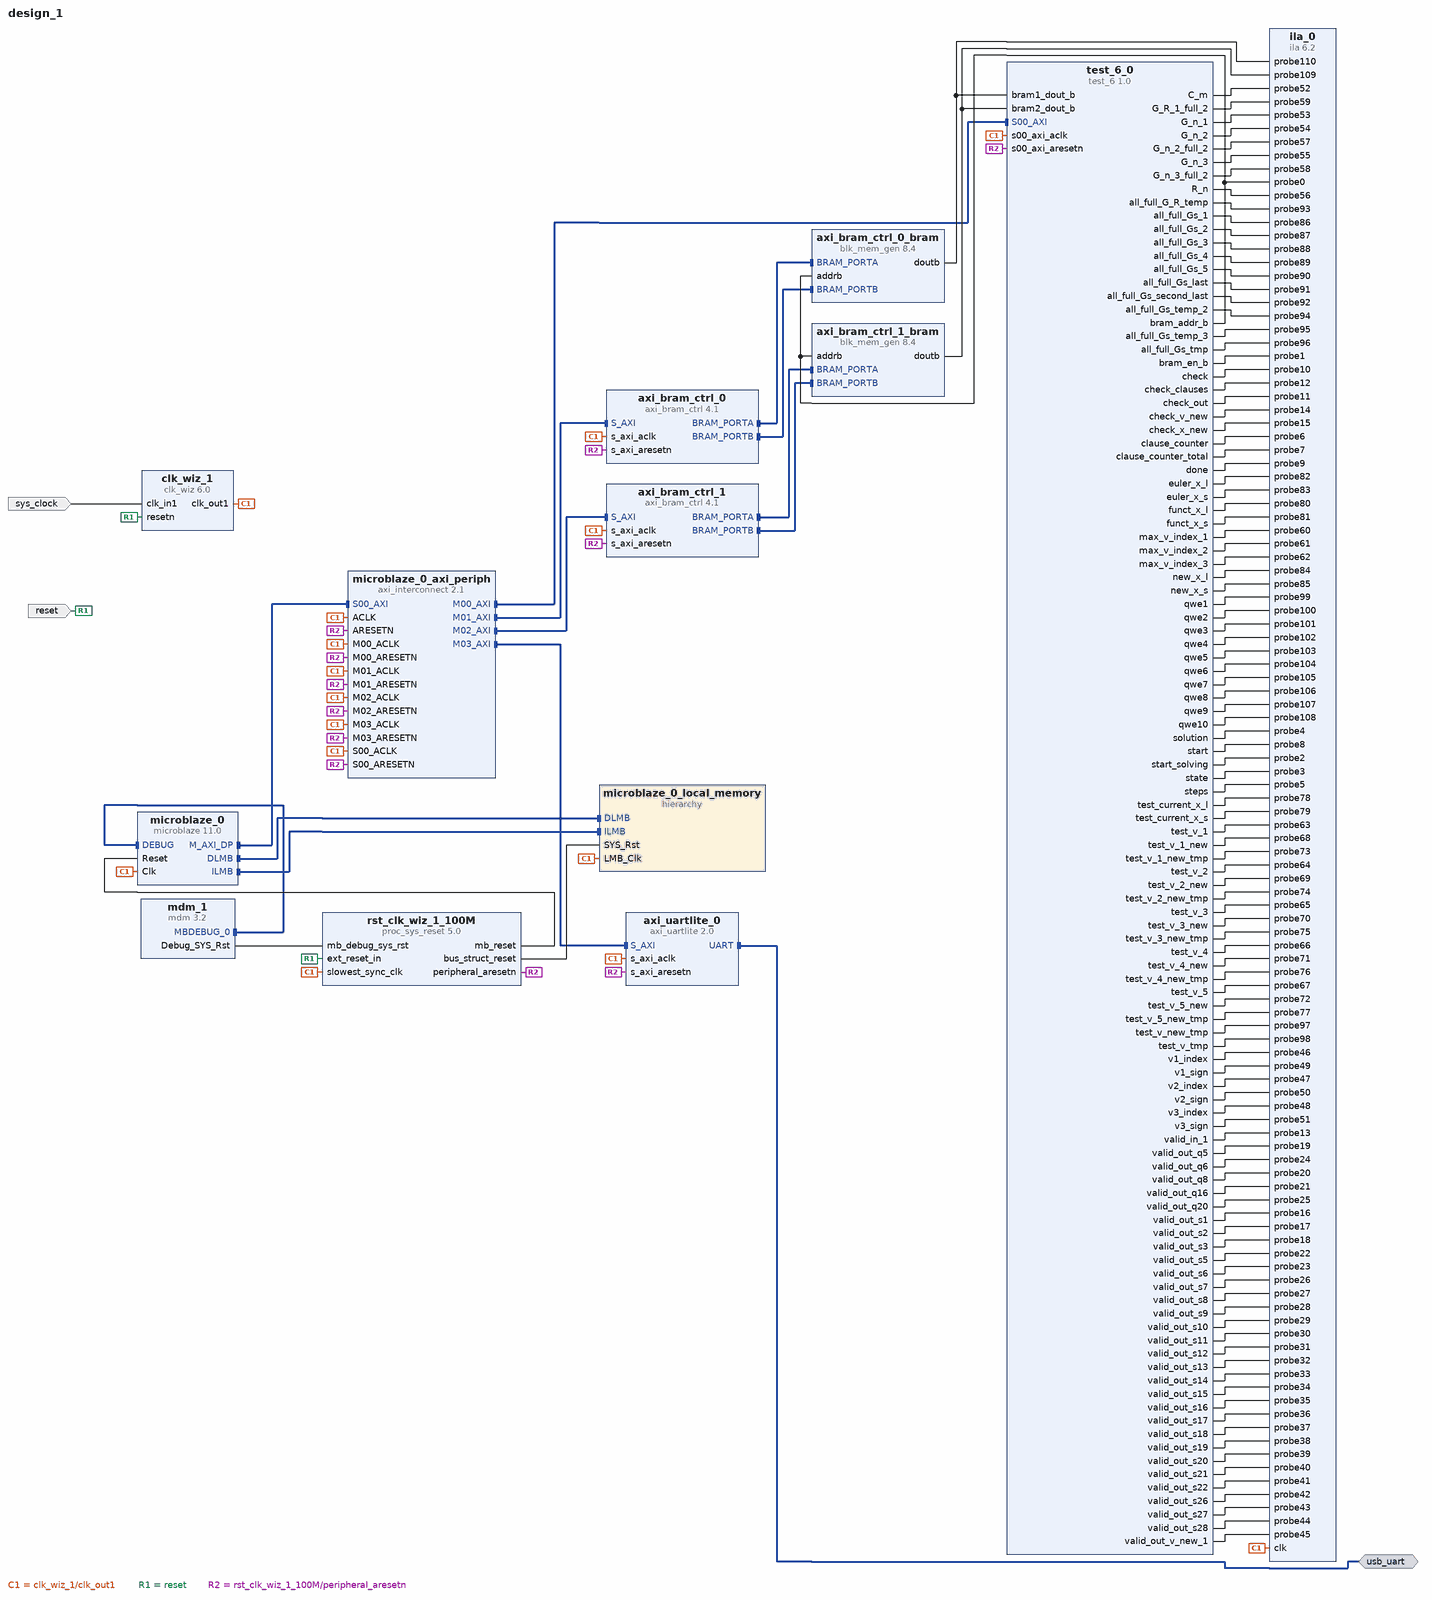
[diagram p0: block diagram of the top level]
# Vivado block design design_1, xc7a100tcsg324-1, Vivado 2023.1
create_bd_design design_1

create_bd_intf_port -mode Master -vlnv xilinx.com:interface:uart_rtl:1.0 usb_uart
create_bd_port -dir I -type clk sys_clock
set_property -dict {CONFIG.FREQ_HZ 100000000 CONFIG.PHASE 0.0} [get_bd_ports sys_clock]
create_bd_port -dir I -type rst reset
set_property -dict {CONFIG.POLARITY ACTIVE_LOW} [get_bd_ports reset]

create_bd_cell -type ip -vlnv xilinx.com:ip:microblaze:11.0 microblaze_0
set_property -dict {CONFIG.C_DEBUG_ENABLED 1 CONFIG.C_D_AXI 1 CONFIG.C_D_LMB 1 CONFIG.C_I_LMB 1} [get_bd_cells microblaze_0]
create_bd_cell -type hier microblaze_0_local_memory
create_bd_cell -type ip -vlnv xilinx.com:ip:mdm:3.2 mdm_1
create_bd_cell -type ip -vlnv xilinx.com:ip:clk_wiz:6.0 clk_wiz_1
set_property -dict [list \
  CONFIG.CLKOUT1_JITTER 137.143 \
  CONFIG.CLKOUT1_PHASE_ERROR 98.575 \
  CONFIG.CLKOUT1_REQUESTED_OUT_FREQ 80.000 \
  CONFIG.CLK_IN1_BOARD_INTERFACE sys_clock \
  CONFIG.MMCM_CLKFBOUT_MULT_F 10.000 \
  CONFIG.MMCM_CLKOUT0_DIVIDE_F 12.500 \
  CONFIG.PRIM_SOURCE Single_ended_clock_capable_pin \
  CONFIG.RESET_BOARD_INTERFACE reset \
  CONFIG.RESET_PORT resetn \
  CONFIG.RESET_TYPE ACTIVE_LOW \
  CONFIG.USE_BOARD_FLOW true \
  CONFIG.USE_LOCKED false \
] [get_bd_cells clk_wiz_1]
create_bd_cell -type ip -vlnv xilinx.com:ip:proc_sys_reset:5.0 rst_clk_wiz_1_100M
set_property -dict {CONFIG.RESET_BOARD_INTERFACE reset CONFIG.USE_BOARD_FLOW true} [get_bd_cells rst_clk_wiz_1_100M]
create_bd_cell -type ip -vlnv xilinx.com:ip:axi_interconnect:2.1 microblaze_0_axi_periph
set_property -dict {CONFIG.NUM_MI 4} [get_bd_cells microblaze_0_axi_periph]
create_bd_cell -type ip -vlnv xilinx.com:ip:axi_bram_ctrl:4.1 axi_bram_ctrl_0
create_bd_cell -type ip -vlnv xilinx.com:ip:blk_mem_gen:8.4 axi_bram_ctrl_0_bram
set_property -dict {CONFIG.Memory_Type True_Dual_Port_RAM} [get_bd_cells axi_bram_ctrl_0_bram]
create_bd_cell -type ip -vlnv xilinx.com:ip:axi_bram_ctrl:4.1 axi_bram_ctrl_1
create_bd_cell -type ip -vlnv xilinx.com:ip:blk_mem_gen:8.4 axi_bram_ctrl_1_bram
set_property -dict {CONFIG.Memory_Type True_Dual_Port_RAM} [get_bd_cells axi_bram_ctrl_1_bram]
create_bd_cell -type ip -vlnv xilinx.com:ip:axi_uartlite:2.0 axi_uartlite_0
set_property -dict {CONFIG.UARTLITE_BOARD_INTERFACE usb_uart CONFIG.USE_BOARD_FLOW true} [get_bd_cells axi_uartlite_0]
create_bd_cell -type ip -vlnv xilinx.com:ip:ila:6.2 ila_0
set_property -dict [list \
  CONFIG.C_MONITOR_TYPE Native \
  CONFIG.C_NUM_OF_PROBES 111 \
  CONFIG.C_PROBE0_WIDTH 32 \
  CONFIG.C_PROBE3_WIDTH 3 \
  CONFIG.C_PROBE4_WIDTH 5 \
] [get_bd_cells ila_0]
create_bd_cell -type ip -vlnv user.org:user:test_6:1.0 test_6_0

# ---- hierarchy /microblaze_0_local_memory ----
current_bd_instance /microblaze_0_local_memory
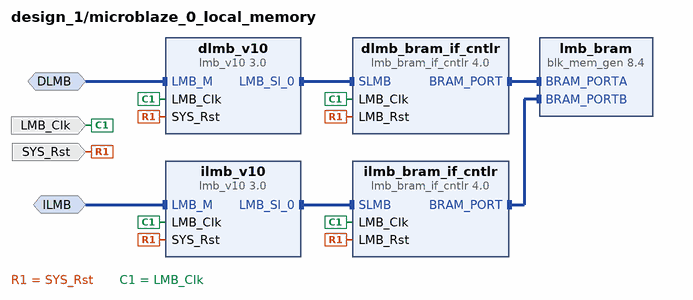
[diagram p1: block diagram inside /microblaze_0_local_memory]
create_bd_intf_pin -mode MirroredMaster -vlnv xilinx.com:interface:lmb_rtl:1.0 DLMB
create_bd_intf_pin -mode MirroredMaster -vlnv xilinx.com:interface:lmb_rtl:1.0 ILMB
create_bd_pin -dir I -type clk LMB_Clk
create_bd_pin -dir I -type rst SYS_Rst

create_bd_cell -type ip -vlnv xilinx.com:ip:lmb_v10:3.0 dlmb_v10
create_bd_cell -type ip -vlnv xilinx.com:ip:lmb_v10:3.0 ilmb_v10
create_bd_cell -type ip -vlnv xilinx.com:ip:lmb_bram_if_cntlr:4.0 dlmb_bram_if_cntlr
set_property -dict {CONFIG.C_ECC 0} [get_bd_cells dlmb_bram_if_cntlr]
create_bd_cell -type ip -vlnv xilinx.com:ip:lmb_bram_if_cntlr:4.0 ilmb_bram_if_cntlr
set_property -dict {CONFIG.C_ECC 0} [get_bd_cells ilmb_bram_if_cntlr]
create_bd_cell -type ip -vlnv xilinx.com:ip:blk_mem_gen:8.4 lmb_bram
set_property -dict {CONFIG.Memory_Type True_Dual_Port_RAM CONFIG.use_bram_block BRAM_Controller} [get_bd_cells lmb_bram]

# ---- connections ----

current_bd_instance /microblaze_0_local_memory
connect_bd_intf_net -intf_net microblaze_0_dlmb [get_bd_intf_pins dlmb_v10/LMB_M] [get_bd_intf_pins DLMB]
connect_bd_intf_net -intf_net microblaze_0_dlmb_bus [get_bd_intf_pins dlmb_v10/LMB_Sl_0] [get_bd_intf_pins dlmb_bram_if_cntlr/SLMB]
connect_bd_intf_net -intf_net microblaze_0_dlmb_cntlr [get_bd_intf_pins dlmb_bram_if_cntlr/BRAM_PORT] [get_bd_intf_pins lmb_bram/BRAM_PORTA]
connect_bd_intf_net -intf_net microblaze_0_ilmb [get_bd_intf_pins ilmb_v10/LMB_M] [get_bd_intf_pins ILMB]
connect_bd_intf_net -intf_net microblaze_0_ilmb_bus [get_bd_intf_pins ilmb_v10/LMB_Sl_0] [get_bd_intf_pins ilmb_bram_if_cntlr/SLMB]
connect_bd_intf_net -intf_net microblaze_0_ilmb_cntlr [get_bd_intf_pins ilmb_bram_if_cntlr/BRAM_PORT] [get_bd_intf_pins lmb_bram/BRAM_PORTB]
connect_bd_net [get_bd_pins SYS_Rst] \
  [get_bd_pins dlmb_v10/SYS_Rst] [get_bd_pins dlmb_bram_if_cntlr/LMB_Rst] [get_bd_pins ilmb_v10/SYS_Rst] \
  [get_bd_pins ilmb_bram_if_cntlr/LMB_Rst]
connect_bd_net -net microblaze_0_Clk [get_bd_pins LMB_Clk] \
  [get_bd_pins dlmb_v10/LMB_Clk] [get_bd_pins dlmb_bram_if_cntlr/LMB_Clk] [get_bd_pins ilmb_v10/LMB_Clk] \
  [get_bd_pins ilmb_bram_if_cntlr/LMB_Clk]
set_property HDL_ATTRIBUTE.BMM_INFO_ADDRESS_SPACE {byte  0x00000000 32 > design_1 microblaze_0_local_memory/lmb_bram} [get_bd_cells dlmb_bram_if_cntlr]
set_property HDL_ATTRIBUTE.KEEP_HIERARCHY yes [get_bd_cells dlmb_bram_if_cntlr]

current_bd_instance /
connect_bd_intf_net [get_bd_intf_pins axi_bram_ctrl_0_bram/BRAM_PORTA] [get_bd_intf_pins axi_bram_ctrl_0/BRAM_PORTA]
connect_bd_intf_net [get_bd_intf_pins axi_bram_ctrl_0_bram/BRAM_PORTB] [get_bd_intf_pins axi_bram_ctrl_0/BRAM_PORTB]
connect_bd_intf_net [get_bd_intf_pins axi_bram_ctrl_1_bram/BRAM_PORTA] [get_bd_intf_pins axi_bram_ctrl_1/BRAM_PORTA]
connect_bd_intf_net [get_bd_intf_pins axi_bram_ctrl_1_bram/BRAM_PORTB] [get_bd_intf_pins axi_bram_ctrl_1/BRAM_PORTB]
connect_bd_intf_net [get_bd_intf_ports usb_uart] [get_bd_intf_pins axi_uartlite_0/UART]
connect_bd_intf_net [get_bd_intf_pins microblaze_0/M_AXI_DP] [get_bd_intf_pins microblaze_0_axi_periph/S00_AXI]
connect_bd_intf_net [get_bd_intf_pins microblaze_0_axi_periph/M00_AXI] [get_bd_intf_pins test_6_0/S00_AXI]
connect_bd_intf_net [get_bd_intf_pins microblaze_0_axi_periph/M01_AXI] [get_bd_intf_pins axi_bram_ctrl_0/S_AXI]
connect_bd_intf_net [get_bd_intf_pins microblaze_0_axi_periph/M02_AXI] [get_bd_intf_pins axi_bram_ctrl_1/S_AXI]
connect_bd_intf_net [get_bd_intf_pins microblaze_0_axi_periph/M03_AXI] [get_bd_intf_pins axi_uartlite_0/S_AXI]
connect_bd_intf_net [get_bd_intf_pins mdm_1/MBDEBUG_0] [get_bd_intf_pins microblaze_0/DEBUG]
connect_bd_intf_net [get_bd_intf_pins microblaze_0/DLMB] [get_bd_intf_pins microblaze_0_local_memory/DLMB]
connect_bd_intf_net [get_bd_intf_pins microblaze_0/ILMB] [get_bd_intf_pins microblaze_0_local_memory/ILMB]
connect_bd_net [get_bd_pins axi_bram_ctrl_0_bram/doutb] [get_bd_pins ila_0/probe110] [get_bd_pins test_6_0/bram1_dout_b]
connect_bd_net [get_bd_pins axi_bram_ctrl_1_bram/doutb] [get_bd_pins ila_0/probe109] [get_bd_pins test_6_0/bram2_dout_b]
connect_bd_net [get_bd_pins mdm_1/Debug_SYS_Rst] [get_bd_pins rst_clk_wiz_1_100M/mb_debug_sys_rst]
connect_bd_net -net microblaze_0_Clk [get_bd_pins clk_wiz_1/clk_out1] \
  [get_bd_pins microblaze_0/Clk] [get_bd_pins microblaze_0_local_memory/LMB_Clk] \
  [get_bd_pins rst_clk_wiz_1_100M/slowest_sync_clk] [get_bd_pins microblaze_0_axi_periph/S00_ACLK] \
  [get_bd_pins microblaze_0_axi_periph/M00_ACLK] [get_bd_pins microblaze_0_axi_periph/ACLK] \
  [get_bd_pins axi_bram_ctrl_0/s_axi_aclk] [get_bd_pins microblaze_0_axi_periph/M01_ACLK] \
  [get_bd_pins axi_bram_ctrl_1/s_axi_aclk] [get_bd_pins microblaze_0_axi_periph/M02_ACLK] \
  [get_bd_pins axi_uartlite_0/s_axi_aclk] [get_bd_pins microblaze_0_axi_periph/M03_ACLK] [get_bd_pins ila_0/clk] \
  [get_bd_pins test_6_0/s00_axi_aclk]
connect_bd_net [get_bd_ports reset] [get_bd_pins clk_wiz_1/resetn] [get_bd_pins rst_clk_wiz_1_100M/ext_reset_in]
connect_bd_net [get_bd_pins rst_clk_wiz_1_100M/bus_struct_reset] [get_bd_pins microblaze_0_local_memory/SYS_Rst]
connect_bd_net [get_bd_pins rst_clk_wiz_1_100M/mb_reset] [get_bd_pins microblaze_0/Reset]
connect_bd_net [get_bd_pins rst_clk_wiz_1_100M/peripheral_aresetn] \
  [get_bd_pins microblaze_0_axi_periph/S00_ARESETN] [get_bd_pins microblaze_0_axi_periph/M00_ARESETN] \
  [get_bd_pins microblaze_0_axi_periph/ARESETN] [get_bd_pins axi_bram_ctrl_0/s_axi_aresetn] \
  [get_bd_pins microblaze_0_axi_periph/M01_ARESETN] [get_bd_pins axi_bram_ctrl_1/s_axi_aresetn] \
  [get_bd_pins microblaze_0_axi_periph/M02_ARESETN] [get_bd_pins axi_uartlite_0/s_axi_aresetn] \
  [get_bd_pins microblaze_0_axi_periph/M03_ARESETN] [get_bd_pins test_6_0/s00_axi_aresetn]
connect_bd_net [get_bd_ports sys_clock] [get_bd_pins clk_wiz_1/clk_in1]
connect_bd_net [get_bd_pins test_6_0/C_m] [get_bd_pins ila_0/probe52]
connect_bd_net [get_bd_pins test_6_0/G_R_1_full_2] [get_bd_pins ila_0/probe59]
connect_bd_net [get_bd_pins test_6_0/G_n_1] [get_bd_pins ila_0/probe53]
connect_bd_net [get_bd_pins test_6_0/G_n_2] [get_bd_pins ila_0/probe54]
connect_bd_net [get_bd_pins test_6_0/G_n_2_full_2] [get_bd_pins ila_0/probe57]
connect_bd_net [get_bd_pins test_6_0/G_n_3] [get_bd_pins ila_0/probe55]
connect_bd_net [get_bd_pins test_6_0/G_n_3_full_2] [get_bd_pins ila_0/probe58]
connect_bd_net [get_bd_pins test_6_0/R_n] [get_bd_pins ila_0/probe56]
connect_bd_net [get_bd_pins test_6_0/all_full_G_R_temp] [get_bd_pins ila_0/probe93]
connect_bd_net [get_bd_pins test_6_0/all_full_Gs_1] [get_bd_pins ila_0/probe86]
connect_bd_net [get_bd_pins test_6_0/all_full_Gs_2] [get_bd_pins ila_0/probe87]
connect_bd_net [get_bd_pins test_6_0/all_full_Gs_3] [get_bd_pins ila_0/probe88]
connect_bd_net [get_bd_pins test_6_0/all_full_Gs_4] [get_bd_pins ila_0/probe89]
connect_bd_net [get_bd_pins test_6_0/all_full_Gs_5] [get_bd_pins ila_0/probe90]
connect_bd_net [get_bd_pins test_6_0/all_full_Gs_last] [get_bd_pins ila_0/probe91]
connect_bd_net [get_bd_pins test_6_0/all_full_Gs_second_last] [get_bd_pins ila_0/probe92]
connect_bd_net [get_bd_pins test_6_0/all_full_Gs_temp_2] [get_bd_pins ila_0/probe94]
connect_bd_net [get_bd_pins test_6_0/all_full_Gs_temp_3] [get_bd_pins ila_0/probe95]
connect_bd_net [get_bd_pins test_6_0/all_full_Gs_tmp] [get_bd_pins ila_0/probe96]
connect_bd_net [get_bd_pins test_6_0/bram_addr_b] \
  [get_bd_pins axi_bram_ctrl_1_bram/addrb] [get_bd_pins axi_bram_ctrl_0_bram/addrb] [get_bd_pins ila_0/probe0]
connect_bd_net [get_bd_pins test_6_0/bram_en_b] [get_bd_pins ila_0/probe1]
connect_bd_net [get_bd_pins test_6_0/check] [get_bd_pins ila_0/probe10]
connect_bd_net [get_bd_pins test_6_0/check_clauses] [get_bd_pins ila_0/probe12]
connect_bd_net [get_bd_pins test_6_0/check_out] [get_bd_pins ila_0/probe11]
connect_bd_net [get_bd_pins test_6_0/check_v_new] [get_bd_pins ila_0/probe14]
connect_bd_net [get_bd_pins test_6_0/check_x_new] [get_bd_pins ila_0/probe15]
connect_bd_net [get_bd_pins test_6_0/clause_counter] [get_bd_pins ila_0/probe6]
connect_bd_net [get_bd_pins test_6_0/clause_counter_total] [get_bd_pins ila_0/probe7]
connect_bd_net [get_bd_pins test_6_0/done] [get_bd_pins ila_0/probe9]
connect_bd_net [get_bd_pins test_6_0/euler_x_l] [get_bd_pins ila_0/probe82]
connect_bd_net [get_bd_pins test_6_0/euler_x_s] [get_bd_pins ila_0/probe83]
connect_bd_net [get_bd_pins test_6_0/funct_x_l] [get_bd_pins ila_0/probe80]
connect_bd_net [get_bd_pins test_6_0/funct_x_s] [get_bd_pins ila_0/probe81]
connect_bd_net [get_bd_pins test_6_0/max_v_index_1] [get_bd_pins ila_0/probe60]
connect_bd_net [get_bd_pins test_6_0/max_v_index_2] [get_bd_pins ila_0/probe61]
connect_bd_net [get_bd_pins test_6_0/max_v_index_3] [get_bd_pins ila_0/probe62]
connect_bd_net [get_bd_pins test_6_0/new_x_l] [get_bd_pins ila_0/probe84]
connect_bd_net [get_bd_pins test_6_0/new_x_s] [get_bd_pins ila_0/probe85]
connect_bd_net [get_bd_pins test_6_0/qwe1] [get_bd_pins ila_0/probe99]
connect_bd_net [get_bd_pins test_6_0/qwe2] [get_bd_pins ila_0/probe100]
connect_bd_net [get_bd_pins test_6_0/qwe3] [get_bd_pins ila_0/probe101]
connect_bd_net [get_bd_pins test_6_0/qwe4] [get_bd_pins ila_0/probe102]
connect_bd_net [get_bd_pins test_6_0/qwe5] [get_bd_pins ila_0/probe103]
connect_bd_net [get_bd_pins test_6_0/qwe6] [get_bd_pins ila_0/probe104]
connect_bd_net [get_bd_pins test_6_0/qwe7] [get_bd_pins ila_0/probe105]
connect_bd_net [get_bd_pins test_6_0/qwe8] [get_bd_pins ila_0/probe106]
connect_bd_net [get_bd_pins test_6_0/qwe9] [get_bd_pins ila_0/probe107]
connect_bd_net [get_bd_pins test_6_0/qwe10] [get_bd_pins ila_0/probe108]
connect_bd_net [get_bd_pins test_6_0/solution] [get_bd_pins ila_0/probe4]
connect_bd_net [get_bd_pins test_6_0/start] [get_bd_pins ila_0/probe8]
connect_bd_net [get_bd_pins test_6_0/start_solving] [get_bd_pins ila_0/probe2]
connect_bd_net [get_bd_pins test_6_0/state] [get_bd_pins ila_0/probe3]
connect_bd_net [get_bd_pins test_6_0/steps] [get_bd_pins ila_0/probe5]
connect_bd_net [get_bd_pins test_6_0/test_current_x_l] [get_bd_pins ila_0/probe78]
connect_bd_net [get_bd_pins test_6_0/test_current_x_s] [get_bd_pins ila_0/probe79]
connect_bd_net [get_bd_pins test_6_0/test_v_1] [get_bd_pins ila_0/probe63]
connect_bd_net [get_bd_pins test_6_0/test_v_1_new] [get_bd_pins ila_0/probe68]
connect_bd_net [get_bd_pins test_6_0/test_v_1_new_tmp] [get_bd_pins ila_0/probe73]
connect_bd_net [get_bd_pins test_6_0/test_v_2] [get_bd_pins ila_0/probe64]
connect_bd_net [get_bd_pins test_6_0/test_v_2_new] [get_bd_pins ila_0/probe69]
connect_bd_net [get_bd_pins test_6_0/test_v_2_new_tmp] [get_bd_pins ila_0/probe74]
connect_bd_net [get_bd_pins test_6_0/test_v_3] [get_bd_pins ila_0/probe65]
connect_bd_net [get_bd_pins test_6_0/test_v_3_new] [get_bd_pins ila_0/probe70]
connect_bd_net [get_bd_pins test_6_0/test_v_3_new_tmp] [get_bd_pins ila_0/probe75]
connect_bd_net [get_bd_pins test_6_0/test_v_4] [get_bd_pins ila_0/probe66]
connect_bd_net [get_bd_pins test_6_0/test_v_4_new] [get_bd_pins ila_0/probe71]
connect_bd_net [get_bd_pins test_6_0/test_v_4_new_tmp] [get_bd_pins ila_0/probe76]
connect_bd_net [get_bd_pins test_6_0/test_v_5] [get_bd_pins ila_0/probe67]
connect_bd_net [get_bd_pins test_6_0/test_v_5_new] [get_bd_pins ila_0/probe72]
connect_bd_net [get_bd_pins test_6_0/test_v_5_new_tmp] [get_bd_pins ila_0/probe77]
connect_bd_net [get_bd_pins test_6_0/test_v_new_tmp] [get_bd_pins ila_0/probe97]
connect_bd_net [get_bd_pins test_6_0/test_v_tmp] [get_bd_pins ila_0/probe98]
connect_bd_net [get_bd_pins test_6_0/v1_index] [get_bd_pins ila_0/probe46]
connect_bd_net [get_bd_pins test_6_0/v1_sign] [get_bd_pins ila_0/probe49]
connect_bd_net [get_bd_pins test_6_0/v2_index] [get_bd_pins ila_0/probe47]
connect_bd_net [get_bd_pins test_6_0/v2_sign] [get_bd_pins ila_0/probe50]
connect_bd_net [get_bd_pins test_6_0/v3_index] [get_bd_pins ila_0/probe48]
connect_bd_net [get_bd_pins test_6_0/v3_sign] [get_bd_pins ila_0/probe51]
connect_bd_net [get_bd_pins test_6_0/valid_in_1] [get_bd_pins ila_0/probe13]
connect_bd_net [get_bd_pins test_6_0/valid_out_q5] [get_bd_pins ila_0/probe19]
connect_bd_net [get_bd_pins test_6_0/valid_out_q6] [get_bd_pins ila_0/probe24]
connect_bd_net [get_bd_pins test_6_0/valid_out_q8] [get_bd_pins ila_0/probe20]
connect_bd_net [get_bd_pins test_6_0/valid_out_q16] [get_bd_pins ila_0/probe21]
connect_bd_net [get_bd_pins test_6_0/valid_out_q20] [get_bd_pins ila_0/probe25]
connect_bd_net [get_bd_pins test_6_0/valid_out_s1] [get_bd_pins ila_0/probe16]
connect_bd_net [get_bd_pins test_6_0/valid_out_s2] [get_bd_pins ila_0/probe17]
connect_bd_net [get_bd_pins test_6_0/valid_out_s3] [get_bd_pins ila_0/probe18]
connect_bd_net [get_bd_pins test_6_0/valid_out_s5] [get_bd_pins ila_0/probe22]
connect_bd_net [get_bd_pins test_6_0/valid_out_s6] [get_bd_pins ila_0/probe23]
connect_bd_net [get_bd_pins test_6_0/valid_out_s7] [get_bd_pins ila_0/probe26]
connect_bd_net [get_bd_pins test_6_0/valid_out_s8] [get_bd_pins ila_0/probe27]
connect_bd_net [get_bd_pins test_6_0/valid_out_s9] [get_bd_pins ila_0/probe28]
connect_bd_net [get_bd_pins test_6_0/valid_out_s10] [get_bd_pins ila_0/probe29]
connect_bd_net [get_bd_pins test_6_0/valid_out_s11] [get_bd_pins ila_0/probe30]
connect_bd_net [get_bd_pins test_6_0/valid_out_s12] [get_bd_pins ila_0/probe31]
connect_bd_net [get_bd_pins test_6_0/valid_out_s13] [get_bd_pins ila_0/probe32]
connect_bd_net [get_bd_pins test_6_0/valid_out_s14] [get_bd_pins ila_0/probe33]
connect_bd_net [get_bd_pins test_6_0/valid_out_s15] [get_bd_pins ila_0/probe34]
connect_bd_net [get_bd_pins test_6_0/valid_out_s16] [get_bd_pins ila_0/probe35]
connect_bd_net [get_bd_pins test_6_0/valid_out_s17] [get_bd_pins ila_0/probe36]
connect_bd_net [get_bd_pins test_6_0/valid_out_s18] [get_bd_pins ila_0/probe37]
connect_bd_net [get_bd_pins test_6_0/valid_out_s19] [get_bd_pins ila_0/probe38]
connect_bd_net [get_bd_pins test_6_0/valid_out_s20] [get_bd_pins ila_0/probe39]
connect_bd_net [get_bd_pins test_6_0/valid_out_s21] [get_bd_pins ila_0/probe40]
connect_bd_net [get_bd_pins test_6_0/valid_out_s22] [get_bd_pins ila_0/probe41]
connect_bd_net [get_bd_pins test_6_0/valid_out_s26] [get_bd_pins ila_0/probe42]
connect_bd_net [get_bd_pins test_6_0/valid_out_s27] [get_bd_pins ila_0/probe43]
connect_bd_net [get_bd_pins test_6_0/valid_out_s28] [get_bd_pins ila_0/probe44]
connect_bd_net [get_bd_pins test_6_0/valid_out_v_new_1] [get_bd_pins ila_0/probe45]
set_property HDL_ATTRIBUTE.BMM_INFO_PROCESSOR {microblaze-le > design_1 microblaze_0_local_memory/dlmb_bram_if_cntlr design_1 axi_bram_ctrl_0 design_1 axi_bram_ctrl_1} [get_bd_cells microblaze_0]
set_property HDL_ATTRIBUTE.KEEP_HIERARCHY yes [get_bd_cells microblaze_0]
set_property HDL_ATTRIBUTE.BMM_INFO_ADDRESS_SPACE {byte  0xC0000000 32 > design_1 axi_bram_ctrl_0_bram} [get_bd_cells axi_bram_ctrl_0]
set_property HDL_ATTRIBUTE.KEEP_HIERARCHY yes [get_bd_cells axi_bram_ctrl_0]
set_property HDL_ATTRIBUTE.BMM_INFO_ADDRESS_SPACE {byte  0xC2000000 32 > design_1 axi_bram_ctrl_1_bram} [get_bd_cells axi_bram_ctrl_1]
set_property HDL_ATTRIBUTE.KEEP_HIERARCHY yes [get_bd_cells axi_bram_ctrl_1]

# ---- address map ----
assign_bd_address -offset 0x00000000 -range 128K -target_address_space [get_bd_addr_spaces microblaze_0/Data] [get_bd_addr_segs microblaze_0_local_memory/dlmb_bram_if_cntlr/SLMB/Mem]
assign_bd_address -offset 0x40600000 -range 64K -target_address_space [get_bd_addr_spaces microblaze_0/Data] [get_bd_addr_segs axi_uartlite_0/S_AXI/Reg]
assign_bd_address -offset 0x44A00000 -range 64K -target_address_space [get_bd_addr_spaces microblaze_0/Data] [get_bd_addr_segs test_6_0/S00_AXI/S00_AXI_reg]
assign_bd_address -offset 0xC0000000 -range 8K -target_address_space [get_bd_addr_spaces microblaze_0/Data] [get_bd_addr_segs axi_bram_ctrl_0/S_AXI/Mem0]
assign_bd_address -offset 0xC2000000 -range 8K -target_address_space [get_bd_addr_spaces microblaze_0/Data] [get_bd_addr_segs axi_bram_ctrl_1/S_AXI/Mem0]
assign_bd_address -offset 0x00000000 -range 128K -target_address_space [get_bd_addr_spaces microblaze_0/Instruction] [get_bd_addr_segs microblaze_0_local_memory/ilmb_bram_if_cntlr/SLMB/Mem]

validate_bd_design
save_bd_design
